# Altium schematic sheet MCU.SchDoc
size A; SheetNumber: 2; SheetTotal: 7
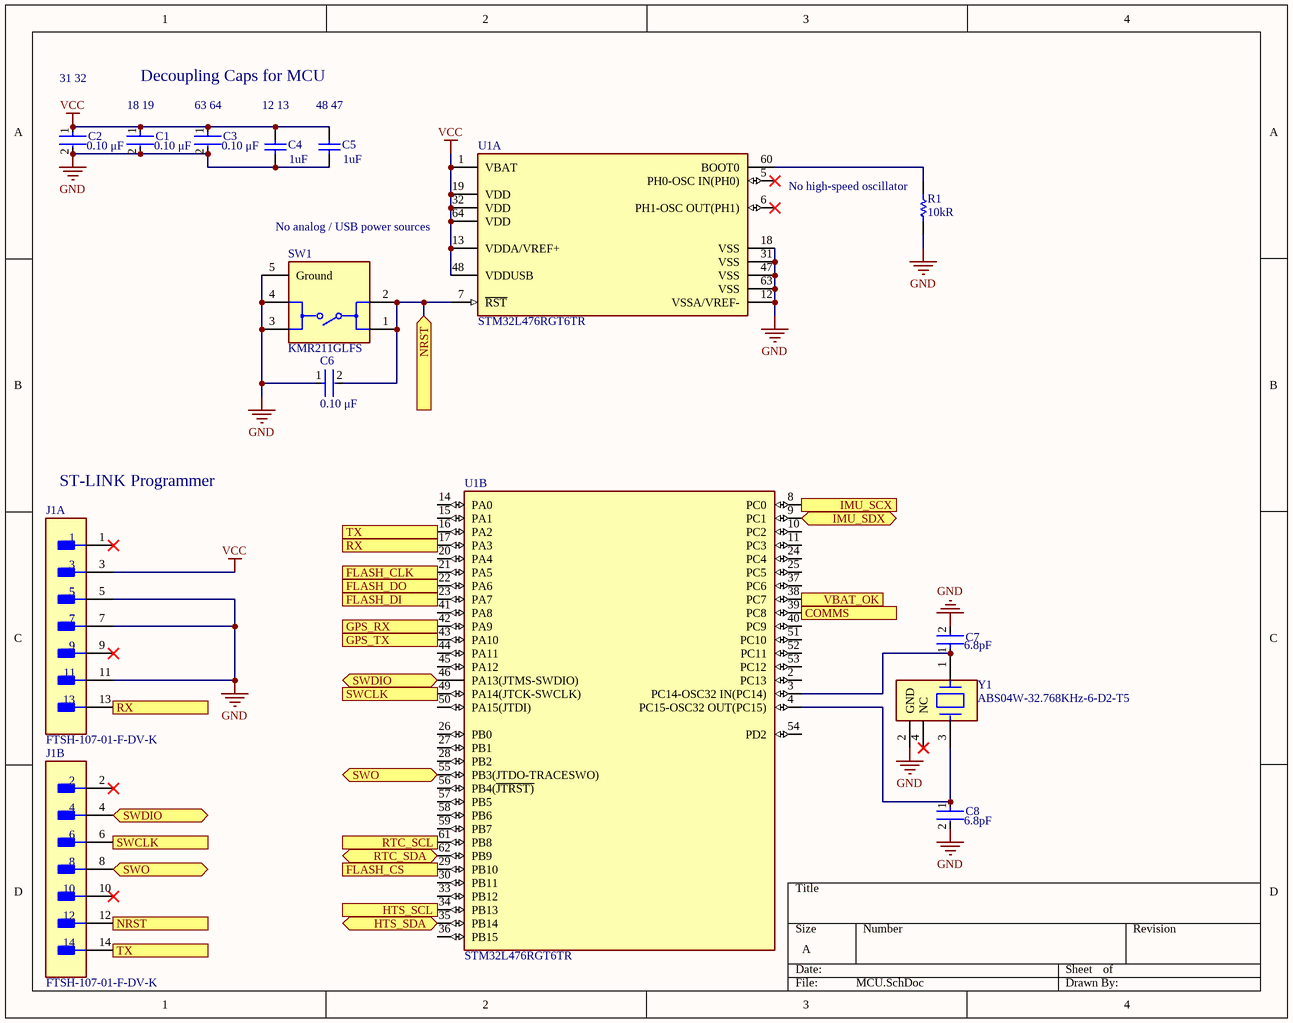
[diagram p0: MCU.SchDoc]

## Parts
C1  Capacitance: 0.10 μF  [FP-C0603C-CF-MFG]  (hidden comment: C0603C104K5RACTU)
C2  Capacitance: 0.10 μF  [FP-C0603C-CF-MFG]  (hidden comment: C0603C104K5RACTU)
C3  Capacitance: 0.10 μF  [FP-C0603C-CF-MFG]  (hidden comment: C0603C104K5RACTU)
C4  Capacitance: 1uF  [CAPC2013X135X45LL10T25]  (hidden comment: GRM21BR71H105KA12L)
C5  Capacitance: 1uF  [CAPC2013X135X45LL10T25]  (hidden comment: GRM21BR71H105KA12L)
C6  Capacitance: 0.10 μF  [FP-C0603C-CF-MFG]  (hidden comment: C0603C104K5RACTU)
C7  Capacitance: 6.8pF  [FP-0805-L_2_01_0_2-W_1_25-MFG]  (hidden comment: 08051A6R8CAT2A)
C8  Capacitance: 6.8pF  [FP-0805-L_2_01_0_2-W_1_25-MFG]  (hidden comment: 08051A6R8CAT2A)
J1  FTSH-107-01-F-DV-K  [FP-FTSH-107-01-F-DV-K-MFG]  (parts A,B of 2)
R1  Resistor: 10kR  [RESC2013X60X35NL10T20]  (hidden comment: RC0805FR-0710KL)
SW1  KMR211GLFS  [FP-KMR211GLFS-MFG]
U1  STM32L476RGT6TR  [FP-LQFP64-5W-MFG]  (parts A,B of 2)
Y1  ABS04W-32.768KHz-6-D2-T5  [FP-ABS04W-MFG]

## Ports
COMMS (out), FLASH_CLK (out), FLASH_CS (out), FLASH_DI (out), FLASH_DO (in), GPS_RX (out), GPS_TX (in), HTS_SCL (out), HTS_SDA (bidir), IMU_SCX (out), IMU_SDX (bidir), NRST (in), NRST (out), RTC_SCL (out), RTC_SDA (bidir), RX (in), RX (out), SWCLK (in), SWCLK (out), SWDIO (bidir), SWO (bidir), TX (in), TX (out), VBAT_OK

## Nets
GND: C1.2 C2.2 C3.2 C4.1 C5.1 C6.1 C7.2 C8.2 J1.5 J1.7 J1.11 R1.1 SW1.3 SW1.4 SW1.5(Ground) U1.12(VSSA/VREF-) U1.18(VSS) U1.31(VSS) U1.47(VSS) U1.63(VSS) Y1.2(GND)
VCC: C1.1 C2.1 C3.1 C4.2 C5.2 J1.3 U1.1(VBAT) U1.13(VDDA/VREF+) U1.19(VDD) U1.32(VDD) U1.48(VDDUSB) U1.64(VDD)
COMMS: U1.39(PC8) ; port COMMS
FLASH_CLK: U1.21(PA5) ; port FLASH_CLK
FLASH_CS: U1.29(PB10) ; port FLASH_CS
FLASH_DI: U1.23(PA7) ; port FLASH_DI
FLASH_DO: U1.22(PA6) ; port FLASH_DO
GPS_RX: U1.42(PA9) ; port GPS_RX
GPS_TX: U1.43(PA10) ; port GPS_TX
HTS_SCL: U1.34(PB13) ; port HTS_SCL
HTS_SDA: U1.35(PB14) ; port HTS_SDA
IMU_SCX: U1.8(PC0) ; port IMU_SCX
IMU_SDX: U1.9(PC1) ; port IMU_SDX
NRST: C6.2 J1.12 SW1.1 SW1.2 U1.7(~{RST}) ; port NRST
RTC_SCL: U1.61(PB8) ; port RTC_SCL
RTC_SDA: U1.62(PB9) ; port RTC_SDA
RX: J1.13 U1.17(PA3) ; port RX
SWCLK: J1.6 U1.49(PA14(JTCK-SWCLK)) ; port SWCLK
SWDIO: J1.4 U1.46(PA13(JTMS-SWDIO)) ; port SWDIO
SWO: J1.8 U1.55(PB3(JTDO-TRACESWO)) ; port SWO
TX: J1.14 U1.16(PA2) ; port TX
VBAT_OK: U1.38(PC7) ; port VBAT_OK
NetC7_1: C7.1 U1.3(PC14-OSC32_IN(PC14)) Y1.1
NetC8_1: C8.1 U1.4(PC15-OSC32_OUT(PC15)) Y1.3
NetR1_2: R1.2 U1.60(BOOT0)

Not connected (* = marked no-connect by the designer): J1 1* 2* 9* 10*; U1 2(PC13) 5(PH0-OSC_IN(PH0))* 6(PH1-OSC_OUT(PH1))* 10(PC2) 11(PC3) 14(PA0) 15(PA1) 20(PA4) 24(PC4) 25(PC5) 26(PB0) 27(PB1) 28(PB2) 30(PB11) 33(PB12) 36(PB15) 37(PC6) 40(PC9) 41(PA8) 44(PA11) 45(PA12) 50(PA15(JTDI)) 51(PC10) 52(PC11) 53(PC12) 54(PD2) 56(PB4(~{JTRST)}) 57(PB5) 58(PB6) 59(PB7); Y1 4(NC)*

## Notes on the sheet
- 31 32
- Decoupling Caps for MCU
- (near C1) 18 19
- (near C3) 63 64
- (near C4) 12 13
- (near C5) 48 47
- No analog / USB power sources
- (near R1) No high-speed oscillator
- ST-LINK Programmer

## Library data of the parts
C1-C3 C6 = CMP-2006-03061-2: CAP CER 0.1UF 50V X7R 0603; Manufacturer: KEMET; Tolerance: 0.1; Temperature Coefficient: 30ppm/°C; Material: Ceramic; Automotive Grade: Grade 1; Value: 0.10 μF; Temperature: -55°C to +125°C; RoHS: TRUE; Temperature Range High: +125°C; Lead Free: Yes; Octopart: https://octopart.com/c0603c104k5ractu-kemet-139244; Digikey Description: CAP CER 0.1UF 50V X7R 0603; Category: Cap; Package: C0603C-CF; ComponentLink2Description: Datasheet; Temperature Range Low: -55°C; Device Class L1: Passive Components; Voltage Rating: 50 V; Automotive: Yes; Device Class L3: Ceramic Capacitors; ComponentLink2URL: https://api.kemet.com/component-edge/download/datasheet/C0603C100J5GACAUTO.pdf; Device Class L2: Capacitors; Manufacturer Part Number: C0603C104K5RACTU; Temperature Characteristic: X7R; Height: 0.87mm
C4 C5 = CMP-1036-04761-2: Manufacturer: Murata; Part Number: GRM21BR71H105KA12L
C7 C8 = CMP-1036-00709-3: General Purpose Ceramic Capacitor, 0805, 6.8pF, 0.25pF, C0G, 30ppm/°C, 100V; Dissipation Factor: 10%; Insulation Resistance: 100GR; Tolerance: 5%; Max Operating Temperature: 125°C; RoHS Compliant: Yes; Termination: SMD/SMT; Number of Pins: 2; Packaging: Tape and Reel; Mount: Surface Mount; Case Code (Metric): 2012; Case Code (Imperial): 0805; Height: 0.71mm; Min Operating Temperature: -55°C; Width: 0.049inch; Temperature Coefficient: 0ppm/°C; Length: 2.01mm; Dielectric: C0G; Series: -; Voltage Rating (DC): 100V; Dielectric Material: Ceramic; Depth: 1.25mm; Contact Plating: Tin; Voltage Rating: 100V; Thickness: 0.037inch; Case/Package: 0805; Lead Free: Lead Free; Radiation Hardening: No; Voltage: 100V; Construction: Flat; Package Quantity: 1; REACH SVHC: No SVHC
J1 = CMP-02766-001448-1: CONN HEADER SMD 14POS 1.27MM; Gender: Male; Connector Type: Male Pin; Number of Contacts: 14; Row Spacing: 0.05inch; Min Operating Temperature: -55°C; Package Quantity: 1; Lead Free: Lead Free; RoHS Compliant: Yes; Contact Material: Bronze; Contact Plating: Gold; Number of Rows: 2; Housing Material: Polymer; Contact Type: Male Pin; Series: FTSH; Max Operating Temperature: 125°C; Orientation: Straight; Number of Positions: 14; Pitch: 1.27mm; Housing Color: Black; Color: Black; Radiation Hardening: No; Length: 8.89mm; Termination: Solder; Packaging: Rail/Tube; Depth: 5.84mm; Mount: Surface Mount; Contact Mating Length: 0.12inch
R1 = CMP-1659-00013-4: Chip Resistor, 10 KOhm, +/- 1%, 0.125 W, -55 to 155 degC, 0805 (2012 Metric), RoHS, Tape and Reel; Manufacturer: Yageo; Voltage Rating: 150 V; Mount: Surface Mount; ComponentLink1Description: Manufacturer URL; ComponentLink2URL: http://www.yageo.com/documents/recent/PYu-RC_Group_51_RoHS_L_04.pdf; Pins: 2; Length: 2 mm; Min Operating Temperature: -55 degC; Height: 0.5 mm; Mounting Technology: Surface Mount; RoHSCompliant: true; REACH SVHC: No SVHC; ComponentLink1URL: http://www.yageo.com/; Max Operating Temperature: 155 degC; PackageReference: 0805; DatasheetVersion: Rev. 4, 02/2016; Package Quantity: 5000; Packaging: Tape and Reel; ComponentLink2Description: Datasheet; PackageDescription: 2-Pin Surface Mounted Device, Body 2 x 1.25 mm
SW1 = CMP-10040-000023-1: SWITCH TACTILE SPST-NO 0.05A 32V; Switch Function: Off-Mom; Throw Configuration: SPST; Switch Travel: 0.2mm; Current Rating: 50mA; Illumination Type: Non-Illuminated; Actuator Length: 0.5mm; Power Rating: 1W; Operating Force: 1.2N; Actuator Type: Standard; Mechanical Life: 200000Cycles; REACH SVHC: No SVHC; Voltage Rating (DC): 32V; Length: 2.8mm; Min Operating Temperature: -40°C; Mount: Surface Mount; Max Voltage Rating (DC): 32V; Width: 2.8mm; Depth: 4.6mm; Packaging: Tape and Reel; Lead Free: Lead Free; Contact Material: Silver; Termination: Gull Wing; Package Quantity: 1; Contact Current Rating: 50mA; Orientation: Straight; Max Operating Temperature: 85°C; Radiation Hardening: No; Max Current Rating: 50mA; Contact Plating: Silver
U1 = CMP-12105-000039-1: IC MCU 32BIT 1MB FLASH 64LQFP; Manufacturer: STMicroelectronics; Number Of Timers/Counters: 13; Number Of Spi Channels: 3; Number Of Pwm Channels: 28; Number Of Usb Channels: 1; Frequency: 80MHz; Data Bus Width: 32bits; Max Supply Voltage: 3.6V; Ram Size: 128KBytes; Memory Size: 1MBytes; Number Of Uart Channels: 6; Number Of Adc Channels: 16; Core Architecture: ARM Cortex-M4; Standoff Height: 0.05mm; Interface: I2C,SPI,UART,USART,CAN,USB,LIN,IrDA,SMBus,Other; Max Junction Temp: +105°C; Min Supply Voltage: 1.71V; Number Of I/Os: 51; Temperature Range Low: -40°C; Automotive: No; Ambient Temperature Range Low: -40°C; ComponentLink2URL: https://www.st.com/content/ccc/resource/technical/document/datasheet/c5/ed/2f/60/aa/79/42/0b/DM00108832.pdf/files/DM00108832.pdf/jcr:content/translations/en.DM00108832.pdf; Temperature: -40°C to +105°C; Device Class L1: Integrated Circuits (ICs); Package: LQFP64-5W; Category: IC; Memory Type: FLASH; Digikey Description: IC MCU 32BIT 1MB FLASH 64LQFP; Number Of A/D Converters: 3; Number Of I2C Channels: 3; Temperature Range High: +105°C; Lead Free: Yes; Number Of Cores: 1; Height: 1.6mm; Ambient Temperature Range High: +85°C; Device Class L2: Embedded Processors and Controllers; Octopart: https://octopart.com/stm32l476rgt6tr-stmicroelectronics-74146120; RoHS: TRUE; Ipc Land Pattern Name: QFP50P1200X1200X160-64; Mouser Description: MCU 32-Bit STM32 ARM Cortex M4 RISC 1MB Flash 1.8V/2.5V/3.3V 64-Pin LQFP T/R; ComponentLink2Description: Datasheet; Manufacturer Part Number: STM32L476RGT6TR; Device Class L3: Microcontrollers
Y1 = CMP-27762-001949-1: CRYSTAL 32.7680KHZ 4PF SMD; RoHS Compliant: Yes